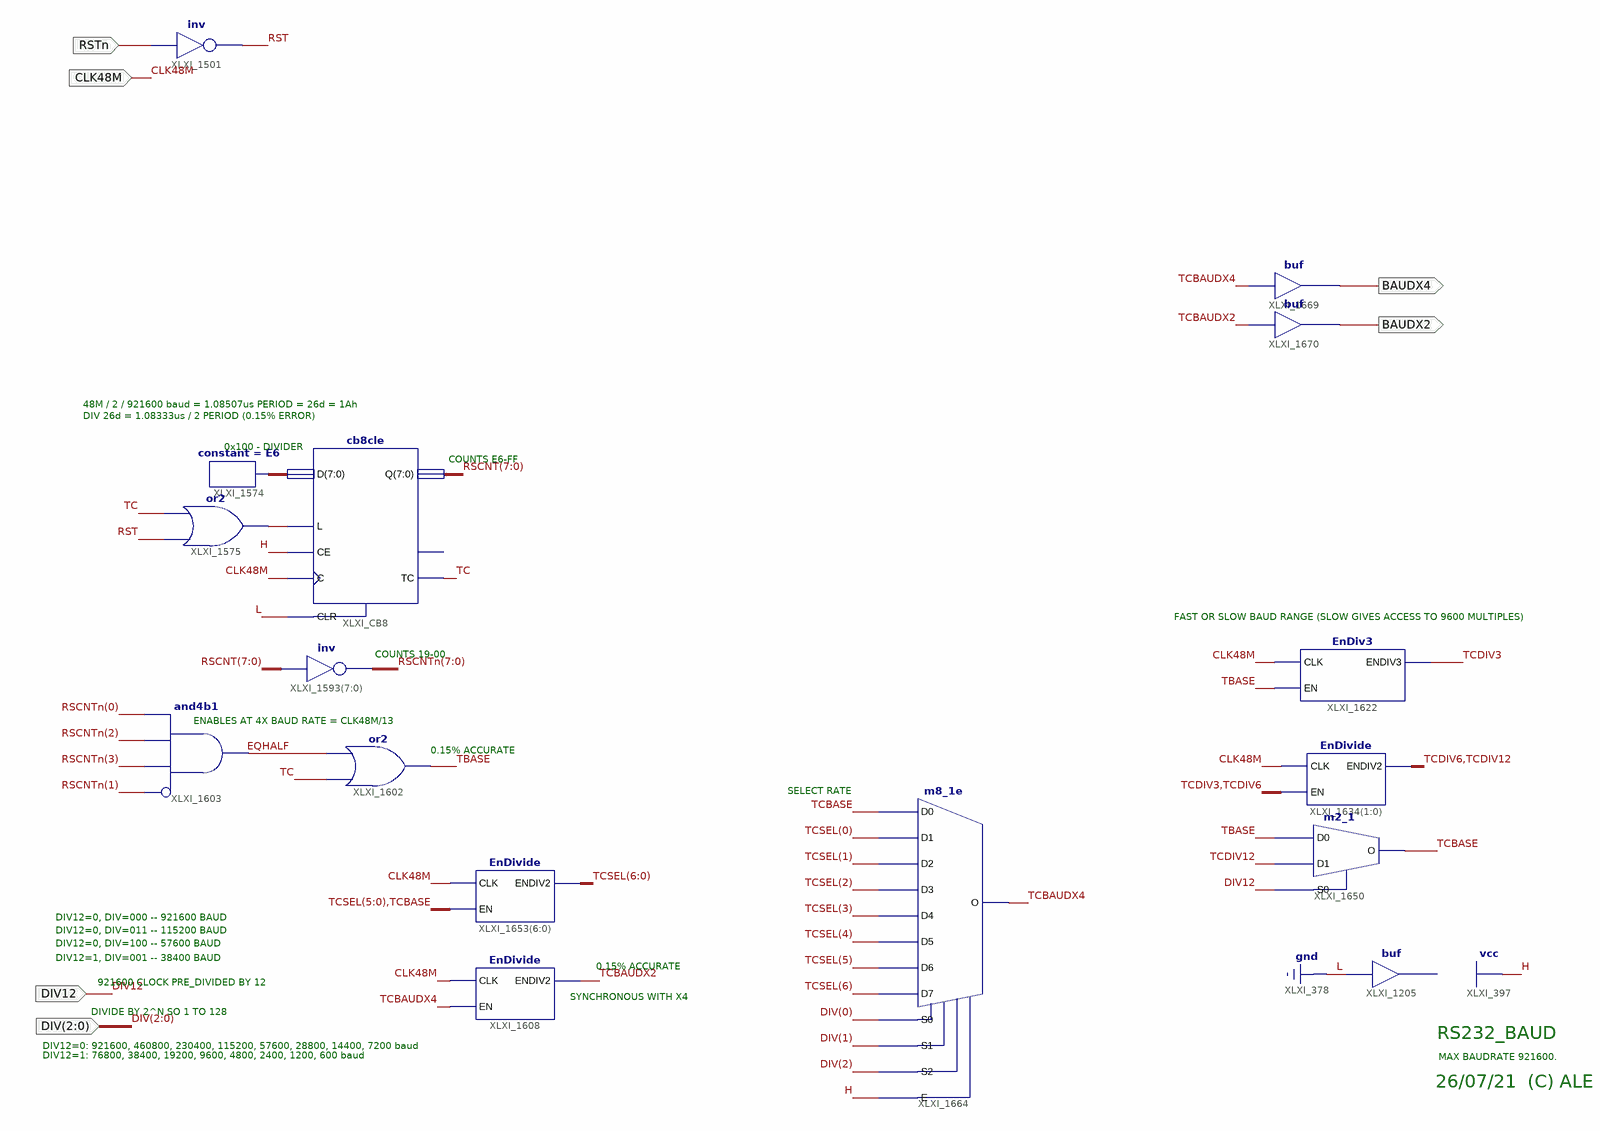
[diagram p0: schematic sheet 1]
// Xilinx ISE schematic RS232_BAUD.sch (spartan3e) as structural Verilog: 16 symbols, 6 ports
module RS232_BAUD (
  input  CLK48M,
  input  RSTn,
  input  DIV12,
  input  [2:0] DIV,
  output BAUDX4,
  output BAUDX2
);

  wire EQHALF, RST, TBASE, TC, TCBASE, TCBAUDX2, TCBAUDX4, TCDIV3, TCDIV6, TCDIV12, XLXN_425;
  wire [6:0] TCSEL;
  wire [7:0] RSCNT, RSCNTn, XLXN_422;

  not XLXI_1501 (RST, RSTn);
  cb8cle XLXI_CB8 (.C(CLK48M), .CE(1'b1), .CLR(1'b0), .D(XLXN_422), .L(XLXN_425), .Q(RSCNT), .TC(TC));  // open: CEO
  constant #(.CValue("E6")) XLXI_1574 (.O(XLXN_422));
  or XLXI_1575 (XLXN_425, RST, TC);
  assign RSCNTn = ~RSCNT;  // inv XLXI_1593[7..0], 8 bits wide
  or XLXI_1602 (TBASE, TC, EQHALF);
  and XLXI_1603 (EQHALF, ~RSCNTn[1], RSCNTn[3], RSCNTn[2], RSCNTn[0]);  // and4b1
  // buf XLXI_1205 has open pins: I=1'b0, O=open
  EnDivide XLXI_1608 (.CLK(CLK48M), .EN(TCBAUDX4), .ENDIV2(TCBAUDX2));
  EnDivide XLXI_1653[6:0] (.CLK(CLK48M), .EN({TCSEL[5:0], TCBASE}), .ENDIV2(TCSEL));
  m8_1e XLXI_1664 (
    .D0(TCBASE), .D1(TCSEL[0]), .D2(TCSEL[1]), .D3(TCSEL[2]), .D4(TCSEL[3]), .D5(TCSEL[4]), .D6(TCSEL[5]),
    .D7(TCSEL[6]), .E(1'b1), .S0(DIV[0]), .S1(DIV[1]), .S2(DIV[2]), .O(TCBAUDX4));
  EnDivide XLXI_1634[1:0] (.CLK(CLK48M), .EN({TCDIV3, TCDIV6}), .ENDIV2({TCDIV6, TCDIV12}));
  EnDiv3 XLXI_1622 (.CLK(CLK48M), .EN(TBASE), .ENDIV3(TCDIV3));
  m2_1 XLXI_1650 (.D0(TBASE), .D1(TCDIV12), .S0(DIV12), .O(TCBASE));
  buf XLXI_1669 (BAUDX4, TCBAUDX4);
  buf XLXI_1670 (BAUDX2, TCBAUDX2);

  // Notes on the sheet:
  //   48M / 2 / 921600 baud = 1.08507us PERIOD = 26d = 1Ah
  //   DIV 26d = 1.08333us / 2 PERIOD (0.15% ERROR)
  //   0x100 - DIVIDER
  //   COUNTS E6-FF
  //   FAST OR SLOW BAUD RANGE (SLOW GIVES ACCESS TO 9600 MULTIPLES)
  //   COUNTS 19-00
  //   ENABLES AT 4X BAUD RATE = CLK48M/13
  //   0.15% ACCURATE
  //   SELECT RATE
  //   DIV12=0, DIV=000 -- 921600 BAUD
  //   DIV12=0, DIV=011 -- 115200 BAUD
  //   DIV12=0, DIV=100 -- 57600 BAUD
  //   DIV12=1, DIV=001 -- 38400 BAUD
  //   0.15% ACCURATE
  //   921600 CLOCK PRE_DIVIDED BY 12
  //   SYNCHRONOUS WITH X4
  //   DIVIDE BY 2^N SO 1 TO 128
  //   RS232_BAUD
  //   DIV12=0: 921600, 460800, 230400, 115200, 57600, 28800, 14400, 7200 baud
  //   DIV12=1: 76800, 38400, 19200, 9600, 4800, 2400, 1200, 600 baud
  //   MAX BAUDRATE 921600.
  //   26/07/21  (C) ALE
endmodule
